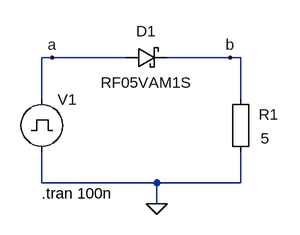
[diagram p0: schematic Diode-trr-3.asc]
Diode-trr-3.asc, the LTspice schematic file:
Version 4
SHEET 1 880 680
WIRE -192 80 -208 80
WIRE -80 80 -192 80
WIRE 80 80 -16 80
WIRE 96 80 80 80
WIRE -208 144 -208 80
WIRE 96 144 96 80
WIRE -208 272 -208 224
WIRE -32 272 -208 272
WIRE 96 272 96 224
WIRE 96 272 -32 272
WIRE -32 304 -32 272
FLAG -32 304 0
FLAG 80 80 b
FLAG -192 80 a
SYMBOL schottky -80 96 R270
WINDOW 0 41 32 VTop 2
WINDOW 3 -7 32 VBottom 2
SYMATTR InstName D1
SYMATTR Value RF05VAM1S
SYMATTR Description Diode
SYMATTR Type diode
SYMBOL Misc\\EuropeanResistor 80 128 R0
WINDOW 0 44 39 Left 2
WINDOW 3 47 76 Left 2
SYMATTR InstName R1
SYMATTR Value 5
SYMBOL pulse -208 128 R0
WINDOW 3 15 105 Invisible 2
WINDOW 123 0 0 Left 0
WINDOW 39 0 0 Left 0
SYMATTR Value PULSE(-10V 10V 20n 1n 1n 20n 200n)
SYMATTR InstName V1
TEXT -208 288 Left 2 !.tran 100n

The netlist it stands for:
* Diode-trr-3.asc
D1 a b RF05VAM1S
R1 b 0 5
V1 a 0 PULSE(-10V 10V 20n 1n 1n 20n 200n)
.model D D
.lib standard.dio
.tran 100n
.backanno
.end